# Altium schematic sheet Core.SchDoc
size A4; SheetNumber: 1; SheetTotal: 4
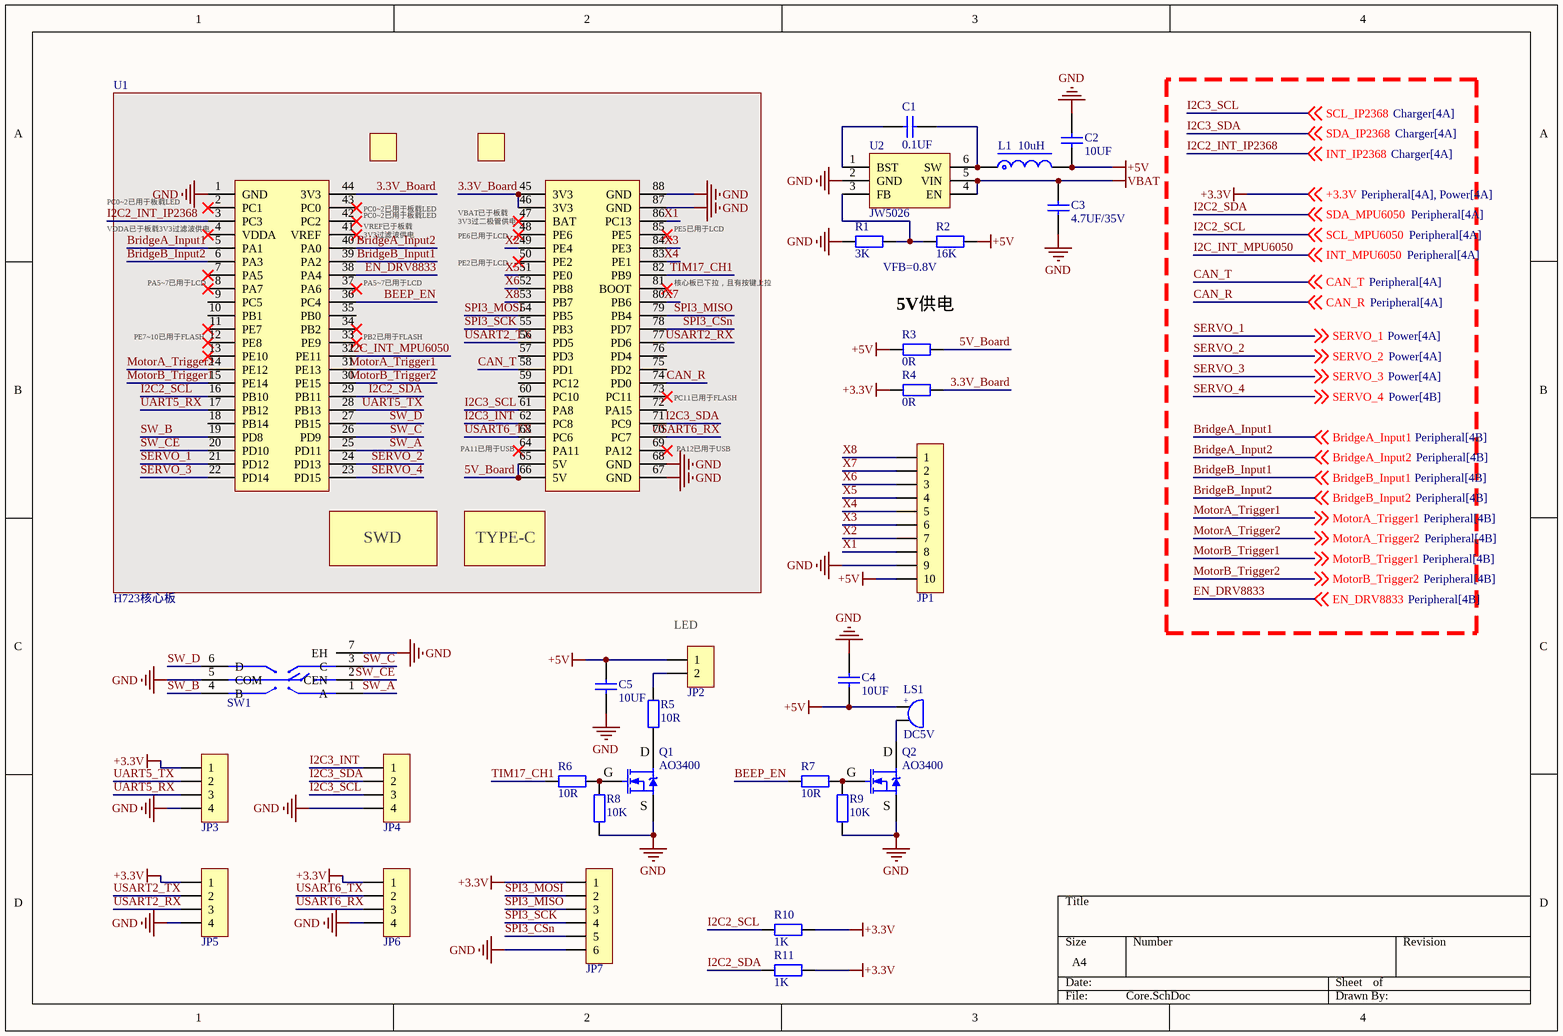
[diagram p0: Core.SchDoc]

## Parts
C1  0.1UF  [C0402_NS]
C2  10UF  [C0805_NS]
C3  4.7UF/35V  [C0603_NS]
C4  10UF  [C0805_NS]
C5  10UF  [C0805_NS]
JP1  HDR-1X10  [HDR2.54-WI-10P]  (value not drawn)
JP2  HDR-1X2  [XH2.54-WI-2P]  (value not drawn)
JP3  HDR-1X4  [XH2.54-WI-4P]  (value not drawn)
JP4  HDR-1X4  [XH2.54-WI-4P]  (value not drawn)
JP5  HDR-1X4  [XH2.54-WI-4P]  (value not drawn)
JP6  HDR-1X4  [HDR2.54-WI-4P]  (value not drawn)
JP7  HDR-1X6  [HDR2.54-WI-6P]  (value not drawn)
L1  10uH  [L-SMD-0420]
LS1  DC5V  [BEEP 5x9x5.5]
Q1  AO3400  [SOT23-3_L2.9_W1.3_P0.95]
Q2  AO3400  [SOT23-3_L2.9_W1.3_P0.95]
R1  3K  [R0402_NS]
R2  16K  [R0402_NS]
R3  0R  [R0805_NS]
R4  0R  [R0805_NS]
R5  10R  [R0603_NS]
R6  10R  [R0603_NS]
R7  10R  [R0603_NS]
R8  10K  [R0603_NS]
R9  10K  [R0603_NS]
R10  1K  [R0402_NS]
R11  1K  [R0402_NS]
SW1  TM-4175-B-A  [SW-SMD_TM-4175-B-X]  (value not drawn)
U1  H723核心板  [H723核心板]
U2  JW5026  [SOT23-6_L3.0_W1.7_P0.95]

## Nets
+3.3V: JP3.1 JP5.1 JP6.1 JP7.1 R4.1 R10.2 R11.2 ; off-sheet +3.3V
+5V: C2.2 C4.1 C5.2 JP1.10 JP2.1 L1.2 LS1.1 R2.1 R3.1
GND: C2.1 C3.1 C4.2 C5.1 JP1.9 JP3.4 JP4.4 JP5.4 JP6.4 JP7.6 Q1.2(S) Q2.2(S) R1.2 R8.2 R9.2 SW1.5(COM) SW1.7(EH) U1.1(GND) U1.67(GND) U1.68(GND) U1.87(GND) U1.88(GND) U2.2(GND)
VBAT: C3.2 U2.4(EN) U2.5(VIN)
3.3V_Board: R4.2 U1.44(3V3) U1.45(3V3) U1.46(3V3)
5V_Board: R3.2 U1.65(5V) U1.66(5V)
BEEP_EN: R7.2 U1.36(PC4)
BridgeA_Input1: U1.5(PA1) ; off-sheet BridgeA_Input1
BridgeA_Input2: U1.40(PA0) ; off-sheet BridgeA_Input2
BridgeB_Input1: U1.39(PA2) ; off-sheet BridgeB_Input1
BridgeB_Input2: U1.6(PA3) ; off-sheet BridgeB_Input2
CAN_R: U1.74(PD0) ; off-sheet CAN_R
CAN_T: U1.58(PD1) ; off-sheet CAN_T
EN_DRV8833: U1.38(PA4) ; off-sheet EN_DRV8833
I2C2_INT_IP2368: U1.3(PC3) ; off-sheet INT_IP2368  [also labelled INT_IP2368]
I2C2_SCL: R10.1 U1.16(PB10) ; off-sheet SCL_MPU6050  [also labelled SCL_MPU6050]
I2C2_SDA: R11.1 U1.29(PB11) ; off-sheet SDA_MPU6050  [also labelled SDA_MPU6050]
I2C3_INT: JP4.1 U1.62(PC8)
I2C3_SCL: JP4.3 U1.61(PA8) ; off-sheet SCL_IP2368  [also labelled SCL_IP2368]
I2C3_SDA: JP4.2 U1.71(PC9) ; off-sheet SDA_IP2368  [also labelled SDA_IP2368]
I2C_INT_MPU6050: U1.32(PE11) ; off-sheet INT_MPU6050  [also labelled INT_MPU6050]
MotorA_Trigger1: U1.31(PE13) ; off-sheet MotorA_Trigger1
MotorA_Trigger2: U1.14(PE12) ; off-sheet MotorA_Trigger2
MotorB_Trigger1: U1.15(PE14) ; off-sheet MotorB_Trigger1
MotorB_Trigger2: U1.30(PE15) ; off-sheet MotorB_Trigger2
SERVO_1: U1.21(PD12) ; off-sheet SERVO_1
SERVO_2: U1.24(PD13) ; off-sheet SERVO_2
SERVO_3: U1.22(PD14) ; off-sheet SERVO_3
SERVO_4: U1.23(PD15) ; off-sheet SERVO_4
SPI3_CSn: JP7.5 U1.78(PD7)
SPI3_MISO: JP7.3 U1.79(PB4)
SPI3_MOSI: JP7.2 U1.54(PB5)
SPI3_SCK: JP7.4 U1.55(PB3)
SW_A: SW1.1(A) U1.25(PD11)
SW_B: SW1.4(B) U1.19(PD8)
SW_C: SW1.3(C) U1.26(PD9)
SW_CE: SW1.2(CEN) U1.20(PD10)
SW_D: SW1.6(D) U1.27(PB15)
TIM17_CH1: R6.2 U1.82(PB9)
UART5_RX: JP3.3 U1.17(PB12)
UART5_TX: JP3.2 U1.28(PB13)
USART2_RX: JP5.3 U1.77(PD6)
USART2_TX: JP5.2 U1.56(PD5)
USART6_RX: JP6.3 U1.70(PC7)
USART6_TX: JP6.2 U1.63(PC6)
X1: JP1.8 U1.86(PC13)
X2: JP1.7 U1.49(PE4)
X3: JP1.6 U1.84(PE3)
X4: JP1.5 U1.83(PE1)
X5: JP1.4 U1.51(PE0)
X6: JP1.3 U1.52(PB8)
X7: JP1.2 U1.80(PB6)
X8: JP1.1 U1.53(PB7)
NetC1_1: C1.1 U2.1(BST)
NetC1_2: C1.2 L1.1 U2.6(SW)
NetJP2_2: JP2.2 R5.2
NetLS1_2: LS1.2 Q2.3(D)
NetQ1_1: Q1.1(G) R6.1 R8.1
NetQ1_3: Q1.3(D) R5.1
NetQ2_1: Q2.1(G) R7.1 R9.1
NetR1_1: R1.1 R2.2 U2.3(FB)

Not connected (* = marked no-connect by the designer): U1 2(PC1)* 4(VDDA)* 7(PA5)* 8(PA7)* 9(PC5) 10(PB1) 11(PE7)* 12(PE8)* 13(PE10)* 18(PB14) 33(PE9)* 34(PB2)* 35(PB0) 37(PA6)* 41(VREF)* 42(PC2)* 43(PC0)* 47(BAT)* 48(PE6)* 50(PE2)* 57(PD3) 59(PC12) 60(PC10) 64(PA11)* 69(PA12)* 72(PA15) 73(PC11)* 75(PD2) 76(PD4) 81(BOOT)* 85(PE5)*

## Notes on the sheet
- PC0~2已用于板载LED
- VDDA已于板载3V3过滤波供电
- (near U1) PC0~2已用于板载LED
- (near U1) VREF已于板载3V3过滤波供电
- (near U1) VBAT已于板载3V3过二极管供电
- (near U1) PE6已用于LCD
- (near U1) PE5已用于LCD
- (near U1) PA5~7已用于LCD
- (near U1) PE2已用于LCD
- (near U1) 核心板已下拉，且有按键上拉
- VFB=0.8V
- 5V供电
- (near U1) PE7~10已用于FLASH
- (near U1) PB2已用于FLASH
- (near U1) PA11已用于USB
- (near U1) PC11已用于FLASH
- (near U1) PA12已用于USB
- (near JP2) LED
- (in symbol BEEP) +
- (in symbol H723核心板) SWD; TYPE-C

## Library data of the parts
C1-C5 = C: 贴片电容/MLCC电容; BOM名称: MLCC
JP1 = Header 10: 10P接插件; BOM名称: 10P接插件
JP2 = Header 2: 2P接插件; BOM名称: 2P接插件
JP3-JP6 = Header 4: 4P接插件; BOM名称: 4P接插件
JP7 = Header 6: 6P接插件; BOM名称: 6P接插件
L1 = L-Molding Choke: 一体成型电感; BOM名称: 一体成型电感
LS1 = BEEP: 蜂鸣器; BOM名称: 蜂鸣器
Q1 Q2 = AO3400: N沟道 30V/4.2A; BOM名称: N沟道场效应管; 参数: N沟道 30V/4.2A
R1-R11 = R: 贴片电阻; BOM名称: 贴片电阻
SW1 = TM-4175-B-A: 五向开关
U2 = JW5026: 40V/1A/1.1MHz同步降压转换器